# Altium schematic sheet STRWHL-S08-V00-ButtonInput.SchDoc: Button Input
size A3; DrawnBy: Jonn Dillon; DocumentNumber: 8; Revision: 00; SheetNumber: 8; SheetTotal: 9; Project: Steering Wheel 2020
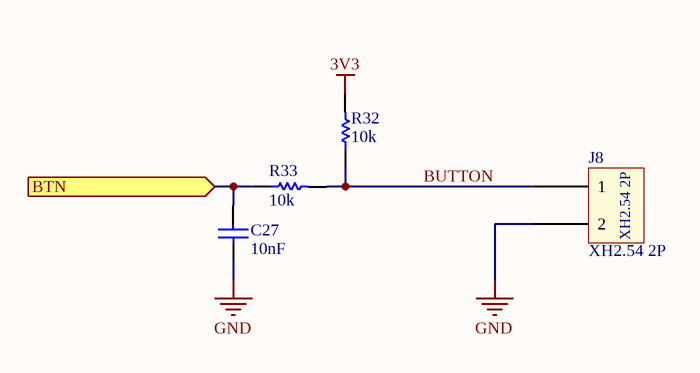
[diagram p0: STRWHL-S08-V00-ButtonInput.SchDoc]

## Parts
C27  10nF  [Cap_Ceramic_0603]
J8  XH2.54 2P  [JST_XH254_2P_TH_RH]
R32  10k  [Res_ThinFilm_0603]
R33  10k  [Res_ThinFilm_0603]

## Ports
BTN (in)

## Nets
3V3: R32.2
GND: C27.1 J8.2
BTN: C27.2 R33.1 ; port BTN
BUTTON: J8.1 R32.1 R33.2

## Notes on the sheet
- Revision History:
- Sheet Title:
- Rev
- Date
- Description
- Project:
- Size:
- Drawn By:
- A3
- Number:
- Revision:
- Sheet
- Version:
- of
- QUT Motorsport
- O-120, Gardens Point
- 2 George Street
- Brisbane, QLD 4000
- Australia
- Print Date:
- Print Time:
- File Name:

## Library data of the parts
C27 = 10nF 50V 5% X7R 0603: Capacitor, Ceramic, SMD, 10nF, 50V, 5%, X7R, 0603
R32 R33 = 10k 5% 0603: Resistor, SMD, 10k, 0.1W, 5%, 0603